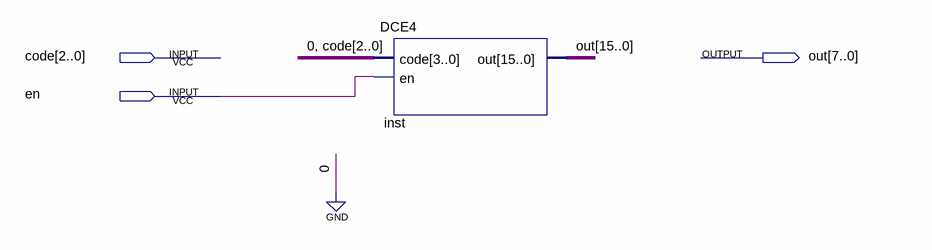
[diagram p0: schematic sheet]
// Quartus schematic DCE3.bdf as structural Verilog: 1 symbols, 3 pins
module DCE3 (
  input  [2:0] code,
  input  en,
  output [15:0] out
);

  DCE4 inst (.code({1'b0, code}), .en(en), .out(out));
endmodule
